# EasyEDA Pro project 键盘.eprj, schematic 键盘原理图

## Sheets
1 键盘按键: Board Name: Board1; Create Date: 2025-09-14; Page Name: 键盘按键; Project Name: 键盘; Schematic Name: Schematic1; Update Date: 2026-02-04; Company: 嘉立创EDA; Page Size: A4; Version: V1.0
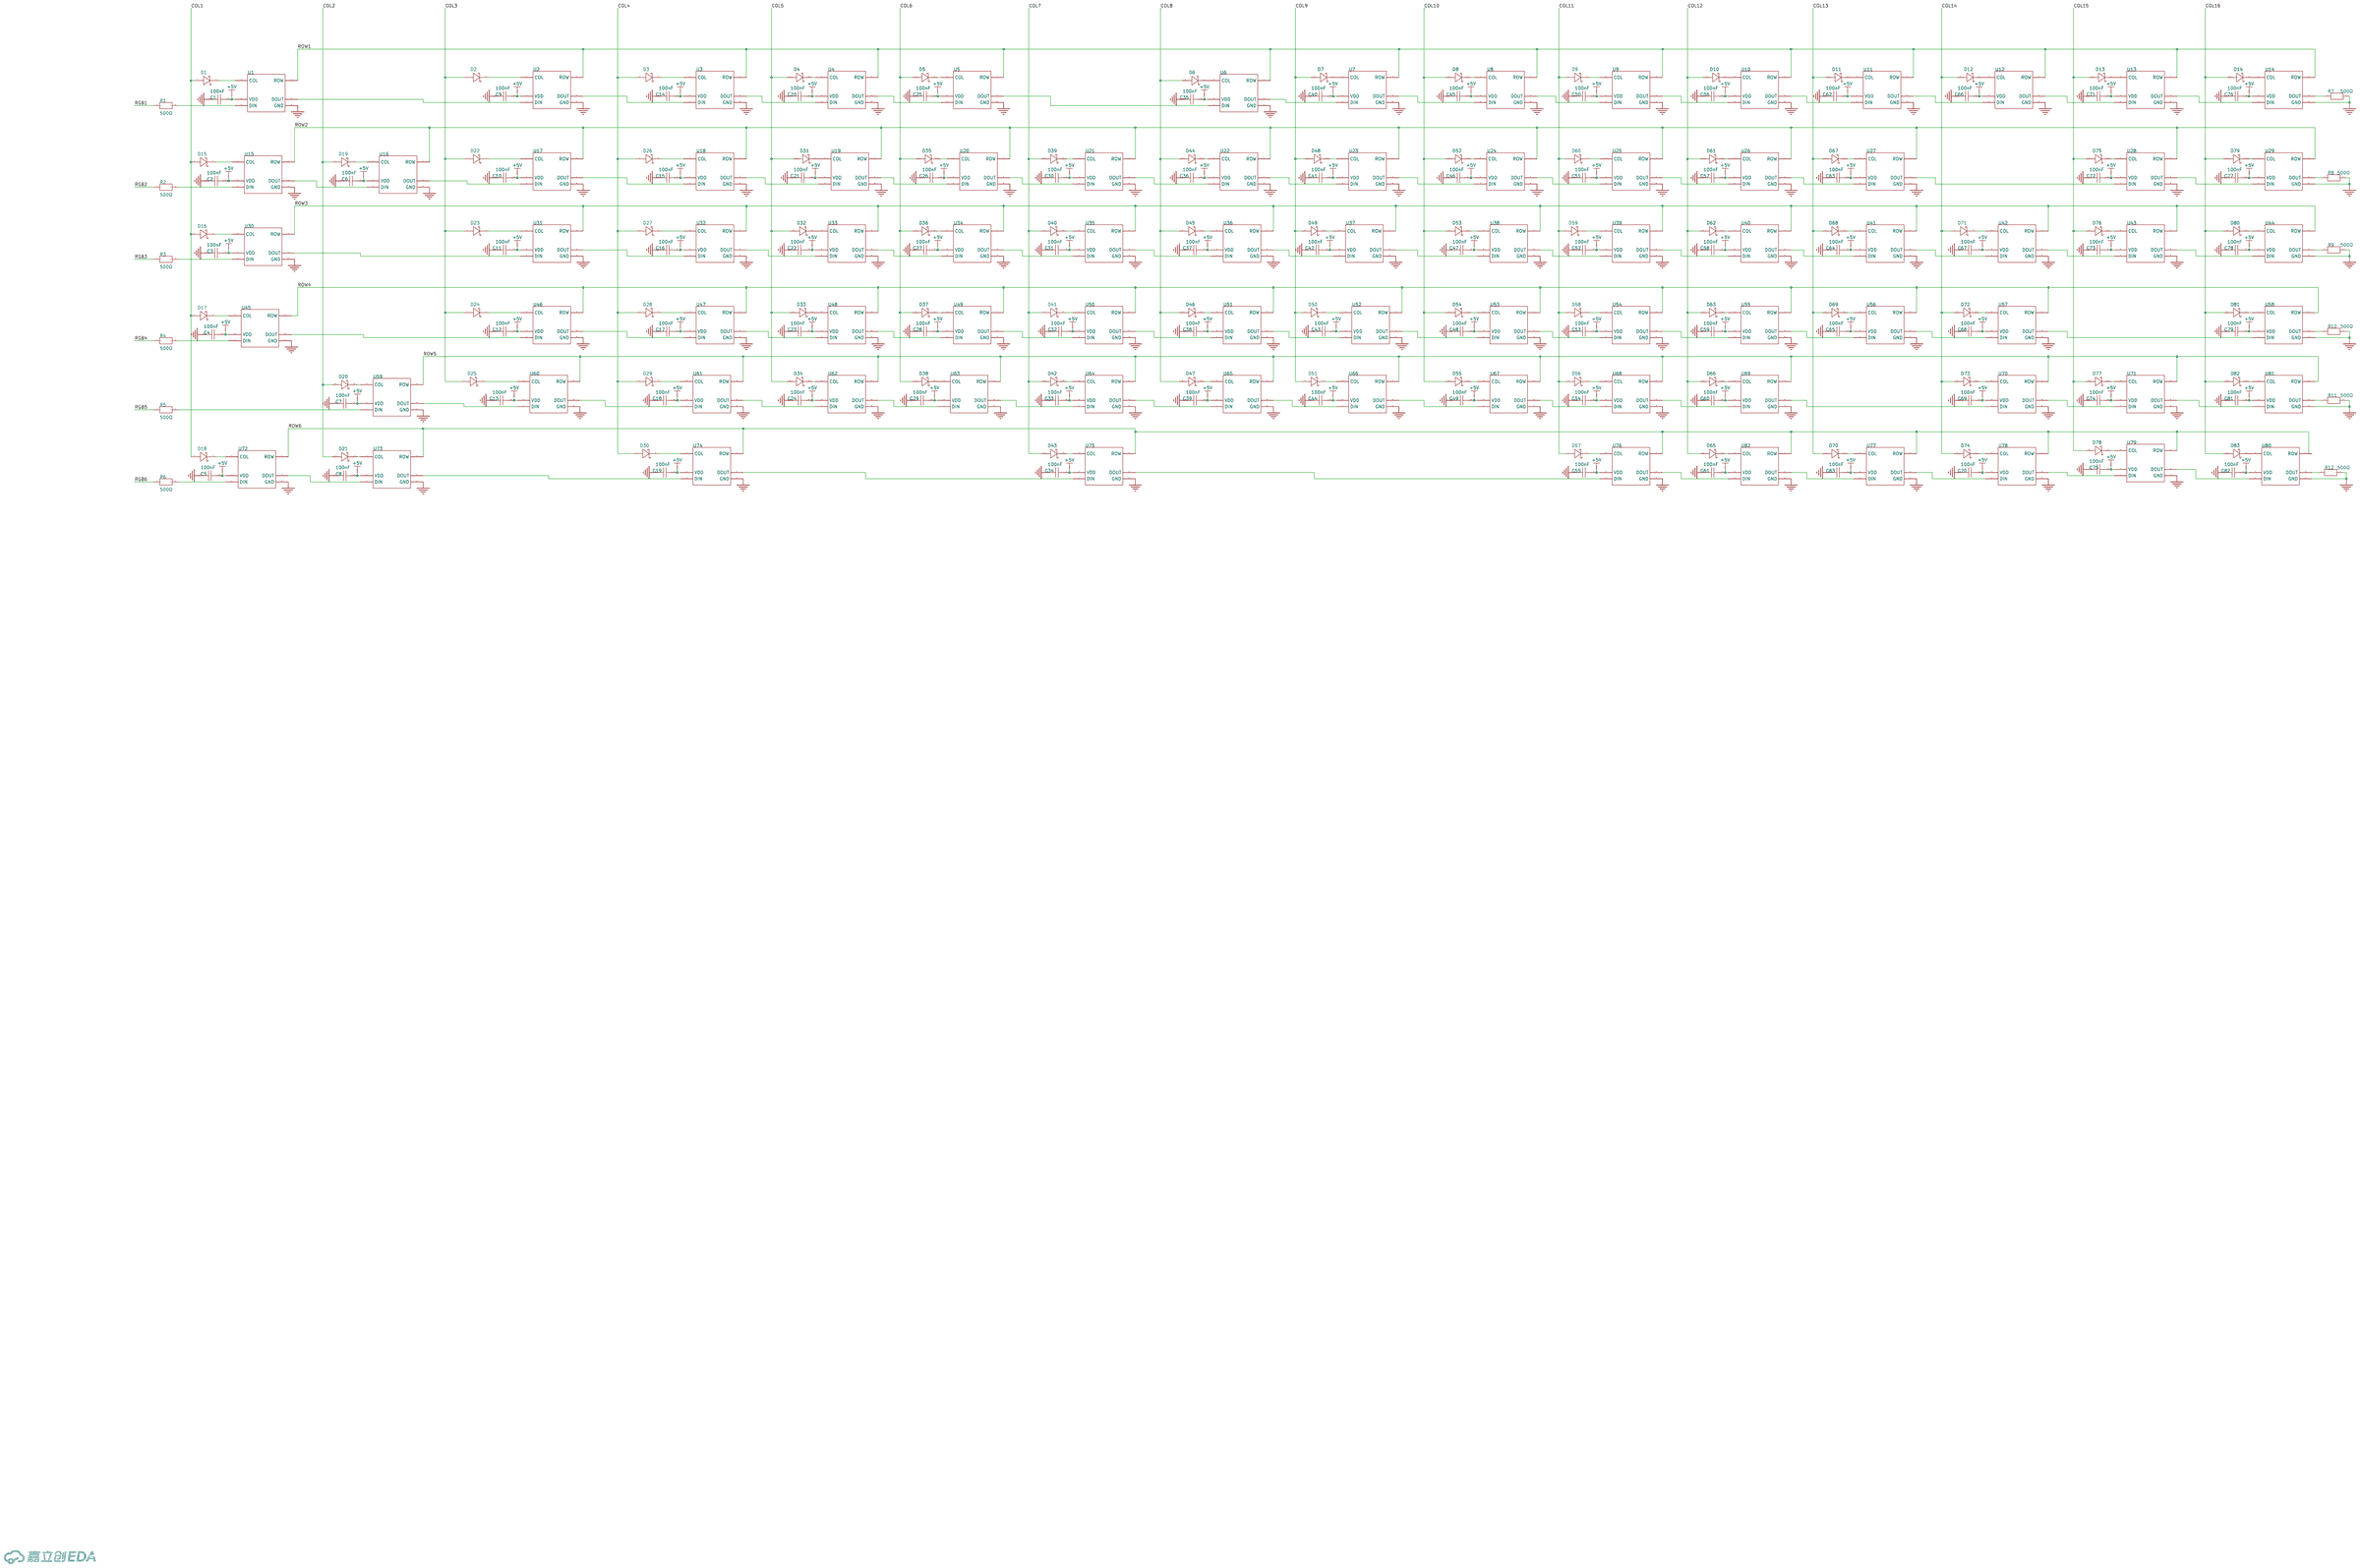
[diagram p0: 键盘按键]
2 键盘主控: Board Name: 键盘pcb; Create Date: 2026-01-15; Page Name: 键盘主控; Schematic Name: 键盘原理图; Update Date: 2026-03-28
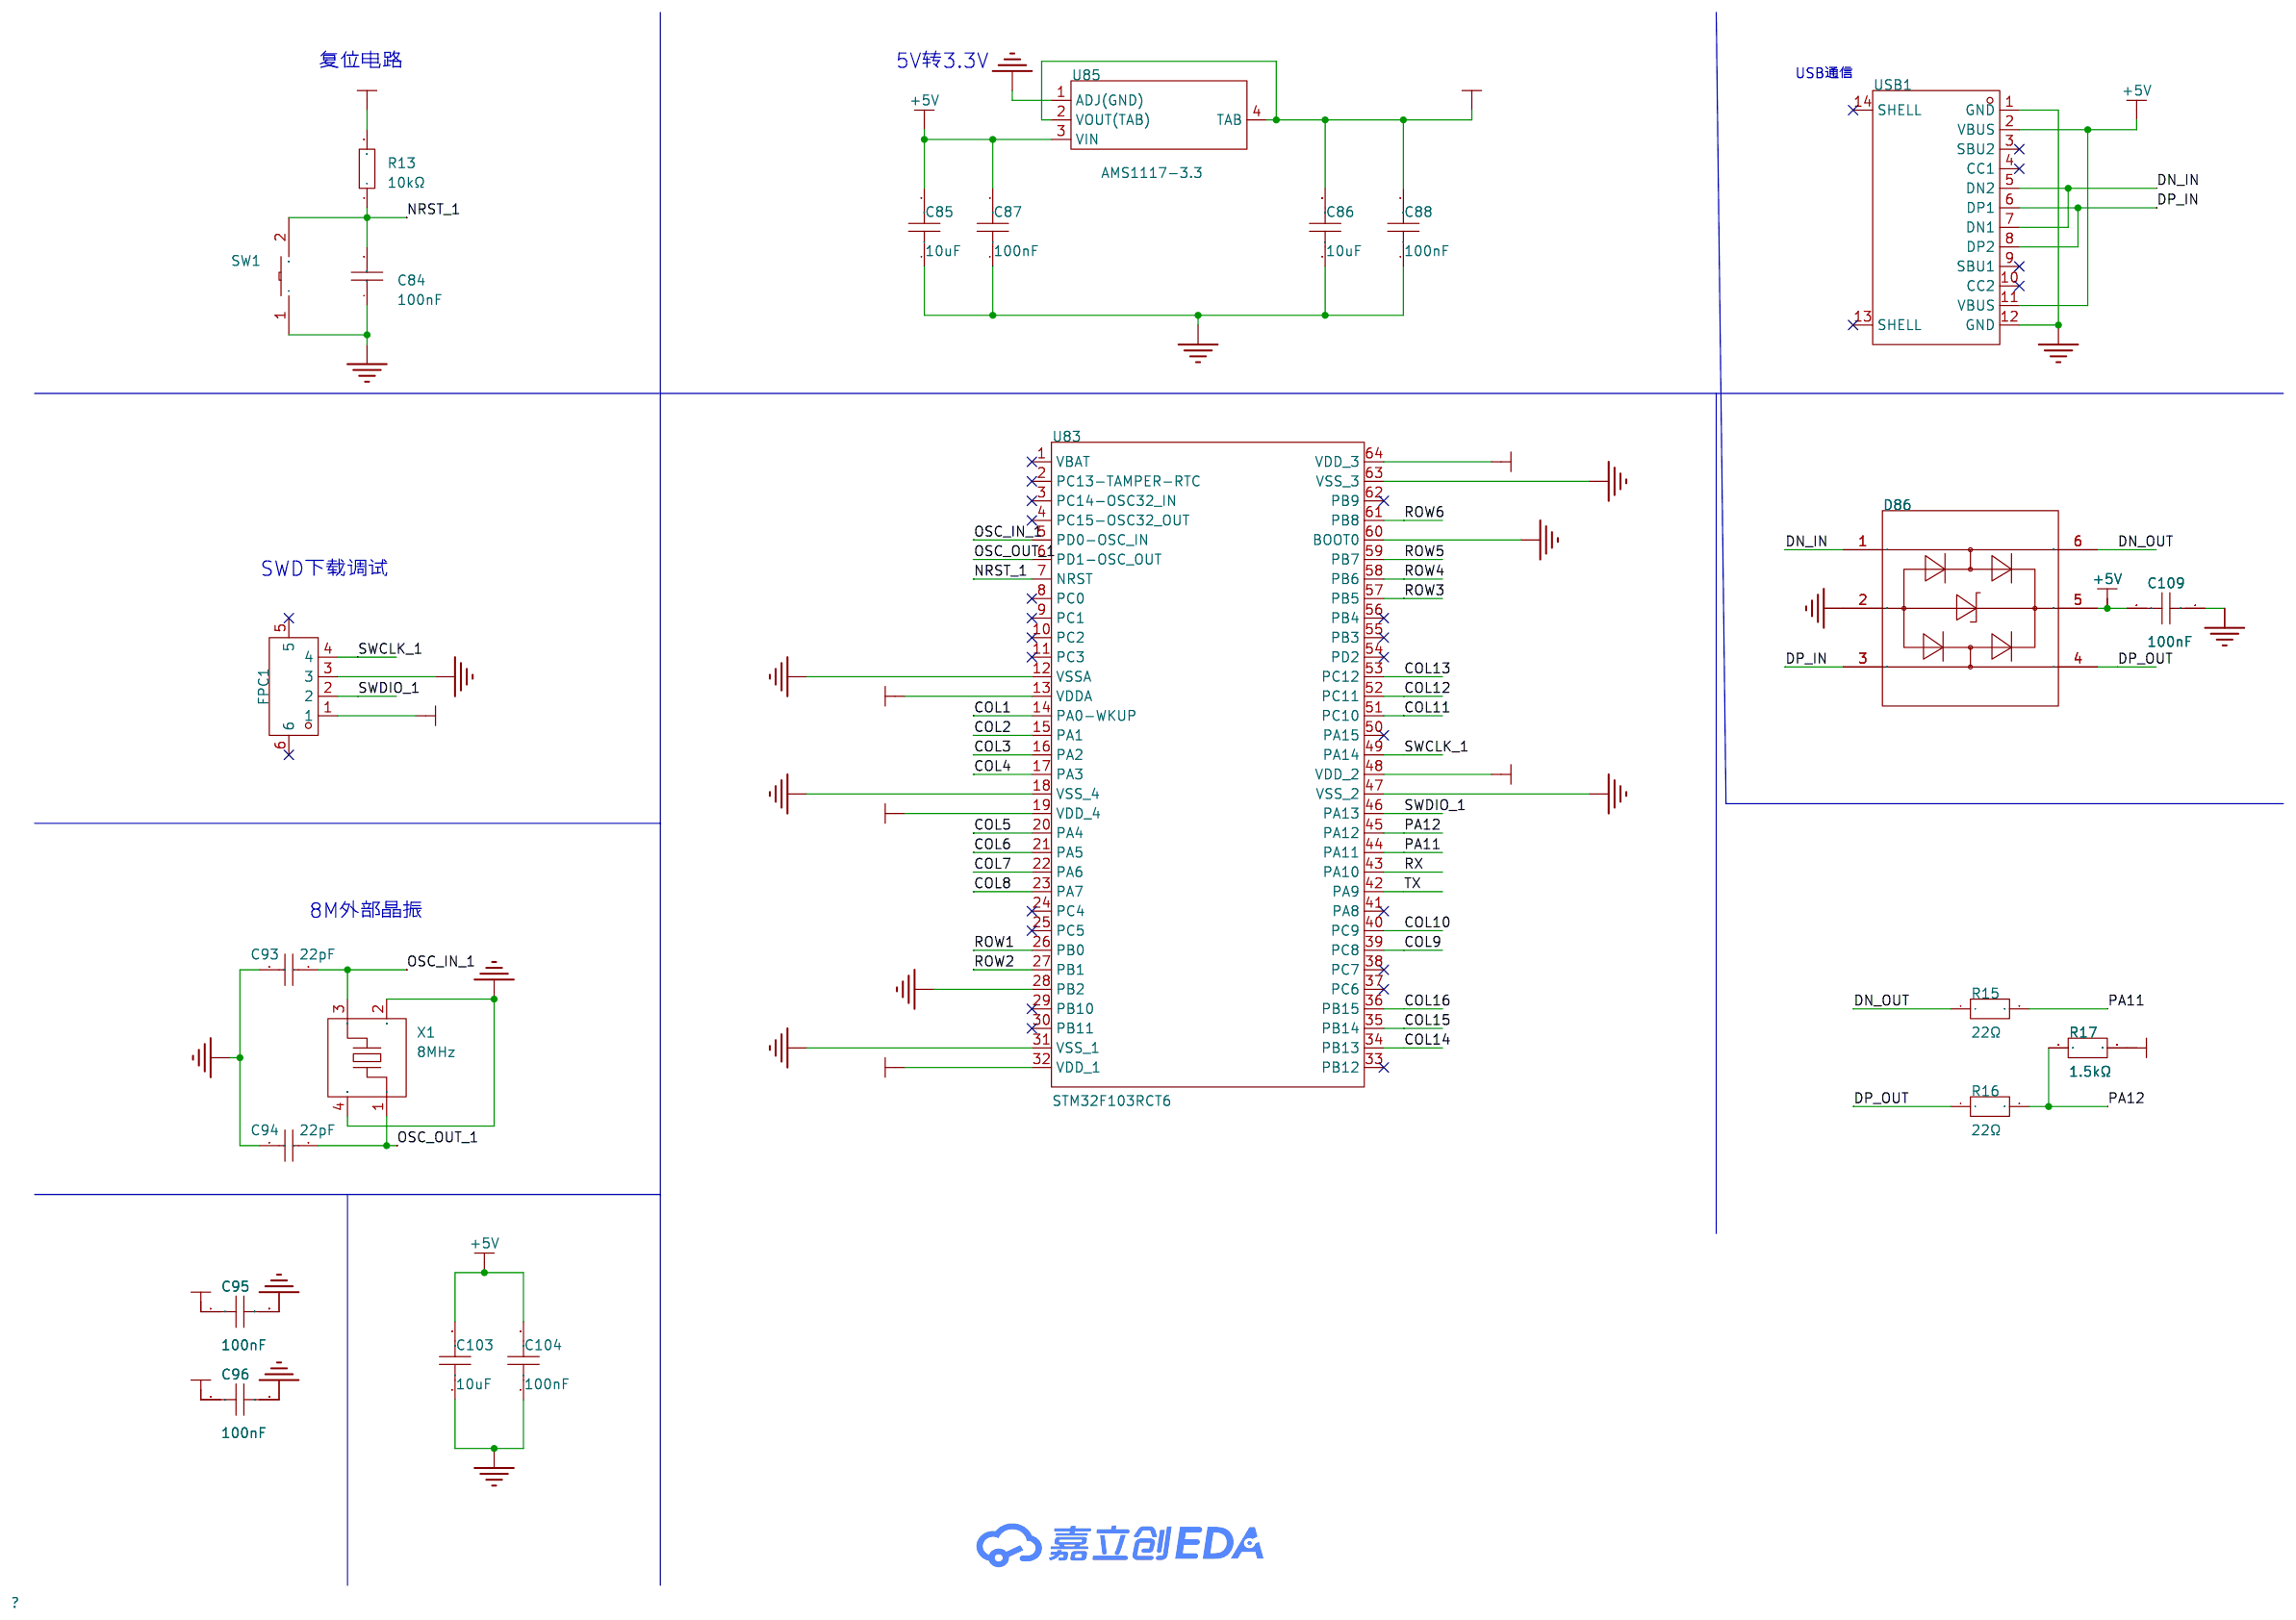
[diagram p1: 键盘主控]
3 灯光主控: Board Name: 键盘pcb; Create Date: 2026-01-15; Page Name: 灯光主控; Schematic Name: 键盘原理图; Update Date: 2026-03-28
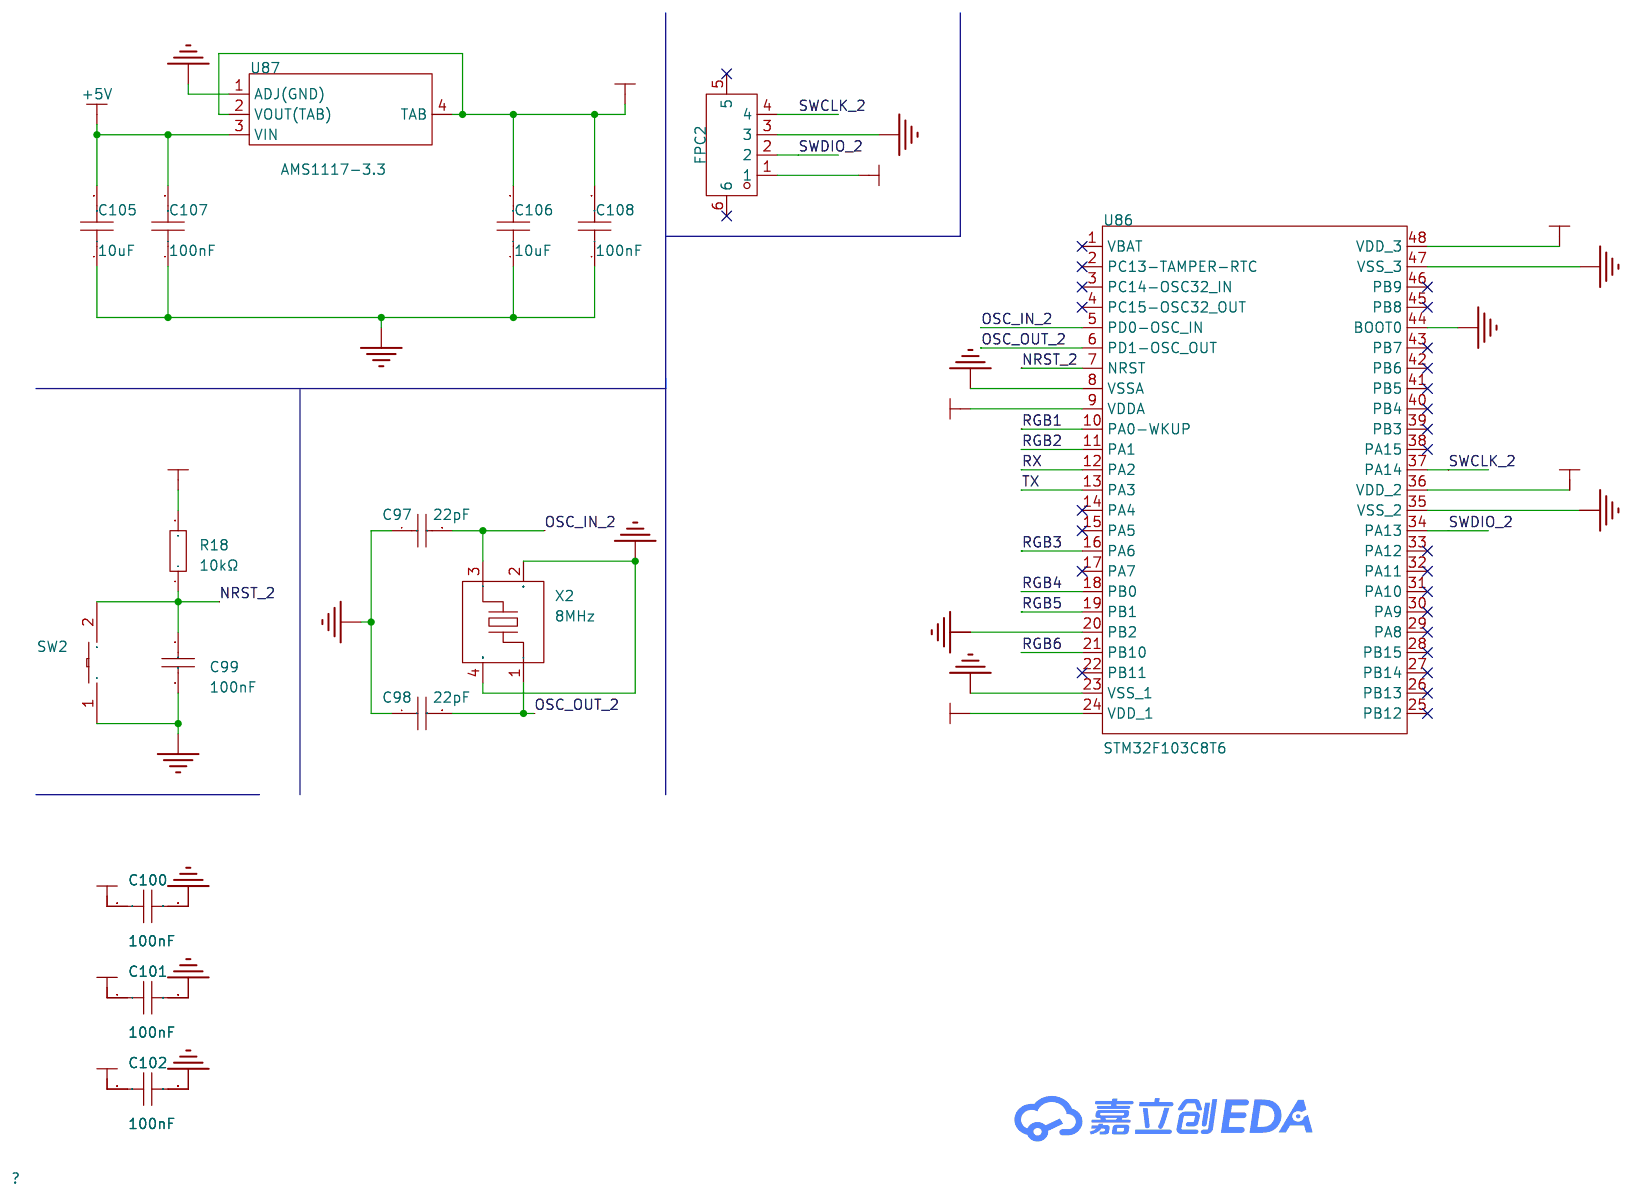
[diagram p2: 灯光主控]

## Parts
sheet 灯光主控
C97  22pF  [C0603]
C98  22pF  [C0603]
C99  100nF  [C0805]
C100  100nF  [C0603]
C101  100nF  [C0603]
C102  100nF  [C0603]
C105  10uF  [C0603]
C106  10uF  [C0603]
C107  100nF  [C0603]
C108  100nF  [C0603]
FPC2  XW05202-040R-00  [FPC-SMD_4P-P0.50_HCTL_XW05202-040R-00]
R18  10kΩ  [R0805]
SW2  TS-1101-C-W  [SW-SMD_L6.0-W3.3-LS8.0]
U86  STM32F103C8T6  [LQFP-48_L7.0-W7.0-P0.50-LS9.0-BL]
U87  AMS1117-3.3  [SOT-223-4_L6.5-W3.5-P2.30-LS7.0-BR]
X2  8MHz  [CRYSTAL-SMD_4P-L3.2-W2.5-BL]
sheet 键盘主控
C84  100nF  [C0805]
C85  10uF  [C0603]
C86  10uF  [C0603]
C87  100nF  [C0603]
C88  100nF  [C0603]
C93  22pF  [C0603]
C94  22pF  [C0603]
C95  100nF  [C0603]
C96  100nF  [C0603]
C103  10uF  [C0603]
C104  100nF  [C0603]
C109  100nF  [C0603]
D86  USBLC6-2SC6  [SOT-23-6_L2.9-W1.6-P0.95-LS2.8-BL]
FPC1  XW05202-040R-00  [FPC-SMD_4P-P0.50_HCTL_XW05202-040R-00]
R13  10kΩ  [R0805]
R15  22Ω  [R0603]
R16  22Ω  [R0603]
R17  1.5kΩ  [R0603]
SW1  TS-1101-C-W  [SW-SMD_L6.0-W3.3-LS8.0]
U83  STM32F103RCT6  [LQFP-64_L10.0-W10.0-P0.50-LS12.0-BL]
U85  AMS1117-3.3  [SOT-223-4_L6.5-W3.5-P2.30-LS7.0-BR]
USB1  TYPE-C 16PIN 2MD(073)  [USB-C-SMD_TYPE-C-6PIN-2MD-073]
X1  8MHz  [CRYSTAL-SMD_4P-L3.2-W2.5-BL]
sheet 键盘按键
C1  100nF  [C0805]
C2  100nF  [C0805]
C3  100nF  [C0805]
C4  100nF  [C0805]
C5  100nF  [C0805]
C6  100nF  [C0805]
C7  100nF  [C0805]
C8  100nF  [C0805]
C9  100nF  [C0805]
C10  100nF  [C0805]
C11  100nF  [C0805]
C12  100nF  [C0805]
C13  100nF  [C0805]
C14  100nF  [C0805]
C15  100nF  [C0805]
C16  100nF  [C0805]
C17  100nF  [C0805]
C18  100nF  [C0805]
C19  100nF  [C0805]
C20  100nF  [C0805]
C21  100nF  [C0805]
C22  100nF  [C0805]
C23  100nF  [C0805]
C24  100nF  [C0805]
C25  100nF  [C0805]
C26  100nF  [C0805]
C27  100nF  [C0805]
C28  100nF  [C0805]
C29  100nF  [C0805]
C30  100nF  [C0805]
C31  100nF  [C0805]
C32  100nF  [C0805]
C33  100nF  [C0805]
C34  100nF  [C0805]
C35  100nF  [C0805]
C36  100nF  [C0805]
C37  100nF  [C0805]
C38  100nF  [C0805]
C39  100nF  [C0805]
C40  100nF  [C0805]
C41  100nF  [C0805]
C42  100nF  [C0805]
C43  100nF  [C0805]
C44  100nF  [C0805]
C45  100nF  [C0805]
C46  100nF  [C0805]
C47  100nF  [C0805]
C48  100nF  [C0805]
C49  100nF  [C0805]
C50  100nF  [C0805]
C51  100nF  [C0805]
C52  100nF  [C0805]
C53  100nF  [C0805]
C54  100nF  [C0805]
C55  100nF  [C0805]
C56  100nF  [C0805]
C57  100nF  [C0805]
C58  100nF  [C0805]
C59  100nF  [C0805]
C60  100nF  [C0805]
C61  100nF  [C0805]
C62  100nF  [C0805]
C63  100nF  [C0805]
C64  100nF  [C0805]
C65  100nF  [C0805]
C66  100nF  [C0805]
C67  100nF  [C0805]
C68  100nF  [C0805]
C69  100nF  [C0805]
C70  100nF  [C0805]
C71  100nF  [C0805]
C72  100nF  [C0805]
C73  100nF  [C0805]
C74  100nF  [C0805]
C75  100nF  [C0805]
C76  100nF  [C0805]
C77  100nF  [C0805]
C78  100nF  [C0805]
C79  100nF  [C0805]
C81  100nF  [C0805]
C82  100nF  [C0805]
C83  100nF  [C0805]
D1  1N4148W  [SOD-123_L2.7-W1.6-LS3.7-FD]
D2  1N4148W  [SOD-123_L2.7-W1.6-LS3.7-FD]
D3  1N4148W  [SOD-123_L2.7-W1.6-LS3.7-FD]
D4  1N4148W  [SOD-123_L2.7-W1.6-LS3.7-FD]
D5  1N4148W  [SOD-123_L2.7-W1.6-LS3.7-FD]
D6  1N4148W  [SOD-123_L2.7-W1.6-LS3.7-FD]
D7  1N4148W  [SOD-123_L2.7-W1.6-LS3.7-FD]
D8  1N4148W  [SOD-123_L2.7-W1.6-LS3.7-FD]
D9  1N4148W  [SOD-123_L2.7-W1.6-LS3.7-FD]
D10  1N4148W  [SOD-123_L2.7-W1.6-LS3.7-FD]
D11  1N4148W  [SOD-123_L2.7-W1.6-LS3.7-FD]
D12  1N4148W  [SOD-123_L2.7-W1.6-LS3.7-FD]
D13  1N4148W  [SOD-123_L2.7-W1.6-LS3.7-FD]
D14  1N4148W  [SOD-123_L2.7-W1.6-LS3.7-FD]
D15  1N4148W  [SOD-123_L2.7-W1.6-LS3.7-FD]
D16  1N4148W  [SOD-123_L2.7-W1.6-LS3.7-FD]
D17  1N4148W  [SOD-123_L2.7-W1.6-LS3.7-FD]
D18  1N4148W  [SOD-123_L2.7-W1.6-LS3.7-FD]
D19  1N4148W  [SOD-123_L2.7-W1.6-LS3.7-FD]
D20  1N4148W  [SOD-123_L2.7-W1.6-LS3.7-FD]
D21  1N4148W  [SOD-123_L2.7-W1.6-LS3.7-FD]
D22  1N4148W  [SOD-123_L2.7-W1.6-LS3.7-FD]
D23  1N4148W  [SOD-123_L2.7-W1.6-LS3.7-FD]
D24  1N4148W  [SOD-123_L2.7-W1.6-LS3.7-FD]
D25  1N4148W  [SOD-123_L2.7-W1.6-LS3.7-FD]
D26  1N4148W  [SOD-123_L2.7-W1.6-LS3.7-FD]
D27  1N4148W  [SOD-123_L2.7-W1.6-LS3.7-FD]
D28  1N4148W  [SOD-123_L2.7-W1.6-LS3.7-FD]
D29  1N4148W  [SOD-123_L2.7-W1.6-LS3.7-FD]
D30  1N4148W  [SOD-123_L2.7-W1.6-LS3.7-FD]
D31  1N4148W  [SOD-123_L2.7-W1.6-LS3.7-FD]
D32  1N4148W  [SOD-123_L2.7-W1.6-LS3.7-FD]
D33  1N4148W  [SOD-123_L2.7-W1.6-LS3.7-FD]
D34  1N4148W  [SOD-123_L2.7-W1.6-LS3.7-FD]
D35  1N4148W  [SOD-123_L2.7-W1.6-LS3.7-FD]
D36  1N4148W  [SOD-123_L2.7-W1.6-LS3.7-FD]
D37  1N4148W  [SOD-123_L2.7-W1.6-LS3.7-FD]
D38  1N4148W  [SOD-123_L2.7-W1.6-LS3.7-FD]
D39  1N4148W  [SOD-123_L2.7-W1.6-LS3.7-FD]
D40  1N4148W  [SOD-123_L2.7-W1.6-LS3.7-FD]
D41  1N4148W  [SOD-123_L2.7-W1.6-LS3.7-FD]
D42  1N4148W  [SOD-123_L2.7-W1.6-LS3.7-FD]
D43  1N4148W  [SOD-123_L2.7-W1.6-LS3.7-FD]
D44  1N4148W  [SOD-123_L2.7-W1.6-LS3.7-FD]
D45  1N4148W  [SOD-123_L2.7-W1.6-LS3.7-FD]
D46  1N4148W  [SOD-123_L2.7-W1.6-LS3.7-FD]
D47  1N4148W  [SOD-123_L2.7-W1.6-LS3.7-FD]
D48  1N4148W  [SOD-123_L2.7-W1.6-LS3.7-FD]
D49  1N4148W  [SOD-123_L2.7-W1.6-LS3.7-FD]
D50  1N4148W  [SOD-123_L2.7-W1.6-LS3.7-FD]
D51  1N4148W  [SOD-123_L2.7-W1.6-LS3.7-FD]
D52  1N4148W  [SOD-123_L2.7-W1.6-LS3.7-FD]
D53  1N4148W  [SOD-123_L2.7-W1.6-LS3.7-FD]
D54  1N4148W  [SOD-123_L2.7-W1.6-LS3.7-FD]
D55  1N4148W  [SOD-123_L2.7-W1.6-LS3.7-FD]
D56  1N4148W  [SOD-123_L2.7-W1.6-LS3.7-FD]
D57  1N4148W  [SOD-123_L2.7-W1.6-LS3.7-FD]
D58  1N4148W  [SOD-123_L2.7-W1.6-LS3.7-FD]
D59  1N4148W  [SOD-123_L2.7-W1.6-LS3.7-FD]
D60  1N4148W  [SOD-123_L2.7-W1.6-LS3.7-FD]
D61  1N4148W  [SOD-123_L2.7-W1.6-LS3.7-FD]
D62  1N4148W  [SOD-123_L2.7-W1.6-LS3.7-FD]
D63  1N4148W  [SOD-123_L2.7-W1.6-LS3.7-FD]
D65  1N4148W  [SOD-123_L2.7-W1.6-LS3.7-FD]
D66  1N4148W  [SOD-123_L2.7-W1.6-LS3.7-FD]
D67  1N4148W  [SOD-123_L2.7-W1.6-LS3.7-FD]
D68  1N4148W  [SOD-123_L2.7-W1.6-LS3.7-FD]
D69  1N4148W  [SOD-123_L2.7-W1.6-LS3.7-FD]
D70  1N4148W  [SOD-123_L2.7-W1.6-LS3.7-FD]
D71  1N4148W  [SOD-123_L2.7-W1.6-LS3.7-FD]
D72  1N4148W  [SOD-123_L2.7-W1.6-LS3.7-FD]
D73  1N4148W  [SOD-123_L2.7-W1.6-LS3.7-FD]
D74  1N4148W  [SOD-123_L2.7-W1.6-LS3.7-FD]
D75  1N4148W  [SOD-123_L2.7-W1.6-LS3.7-FD]
D76  1N4148W  [SOD-123_L2.7-W1.6-LS3.7-FD]
D77  1N4148W  [SOD-123_L2.7-W1.6-LS3.7-FD]
D78  1N4148W  [SOD-123_L2.7-W1.6-LS3.7-FD]
D79  1N4148W  [SOD-123_L2.7-W1.6-LS3.7-FD]
D80  1N4148W  [SOD-123_L2.7-W1.6-LS3.7-FD]
D81  1N4148W  [SOD-123_L2.7-W1.6-LS3.7-FD]
D82  1N4148W  [SOD-123_L2.7-W1.6-LS3.7-FD]
D83  1N4148W  [SOD-123_L2.7-W1.6-LS3.7-FD]
R1  500Ω  [R0805]
R2  500Ω  [R0805]
R3  500Ω  [R0805]
R4  500Ω  [R0805]
R5  500Ω  [R0805]
R6  500Ω  [R0805]
R7  500Ω  [R0805]
R8  500Ω  [R0805]
R9  500Ω  [R0805]
R10  500Ω  [R0805]
R11  500Ω  [R0805]
R12  500Ω  [R0805]
U1  -  [凯华rgb轴座5脚]
U2  -  [凯华rgb轴座5脚]
U3  -  [凯华rgb轴座5脚]
U4  -  [凯华rgb轴座5脚]
U5  -  [凯华rgb轴座5脚]
U6  -  [凯华rgb轴座5脚]
U7  -  [凯华rgb轴座5脚]
U8  -  [凯华rgb轴座5脚]
U9  -  [凯华rgb轴座5脚]
U10  -  [凯华rgb轴座5脚]
U11  -  [凯华rgb轴座5脚]
U12  -  [凯华rgb轴座5脚]
U13  -  [凯华rgb轴座5脚]
U14  -  [凯华rgb轴座5脚]
U15  -  [凯华rgb轴座5脚]
U16  -  [凯华rgb轴座5脚]
U17  -  [凯华rgb轴座5脚]
U18  -  [凯华rgb轴座5脚]
U19  -  [凯华rgb轴座5脚]
U20  -  [凯华rgb轴座5脚]
U21  -  [凯华rgb轴座5脚]
U22  -  [凯华rgb轴座5脚]
U23  -  [凯华rgb轴座5脚]
U24  -  [凯华rgb轴座5脚]
U25  -  [凯华rgb轴座5脚]
U26  -  [凯华rgb轴座5脚]
U27  -  [凯华rgb轴座5脚]
U28  -  [凯华rgb轴座5脚]
U29  -  [凯华rgb轴座5脚]
U30  -  [凯华rgb轴座5脚]
U31  -  [凯华rgb轴座5脚]
U32  -  [凯华rgb轴座5脚]
U33  -  [凯华rgb轴座5脚]
U34  -  [凯华rgb轴座5脚]
U35  -  [凯华rgb轴座5脚]
U36  -  [凯华rgb轴座5脚]
U37  -  [凯华rgb轴座5脚]
U38  -  [凯华rgb轴座5脚]
U39  -  [凯华rgb轴座5脚]
U40  -  [凯华rgb轴座5脚]
U41  -  [凯华rgb轴座5脚]
U42  -  [凯华rgb轴座5脚]
U43  -  [凯华rgb轴座5脚]
U44  -  [凯华rgb轴座5脚]
U45  -  [凯华rgb轴座5脚]
U46  -  [凯华rgb轴座5脚]
U47  -  [凯华rgb轴座5脚]
U48  -  [凯华rgb轴座5脚]
U49  -  [凯华rgb轴座5脚]
U50  -  [凯华rgb轴座5脚]
U51  -  [凯华rgb轴座5脚]
U52  -  [凯华rgb轴座5脚]
U53  -  [凯华rgb轴座5脚]
U54  -  [凯华rgb轴座5脚]
U55  -  [凯华rgb轴座5脚]
U56  -  [凯华rgb轴座5脚]
U57  -  [凯华rgb轴座5脚]
U58  -  [凯华rgb轴座5脚]
U59  -  [凯华rgb轴座5脚]
U60  -  [凯华rgb轴座5脚]
U61  -  [凯华rgb轴座5脚]
U62  -  [凯华rgb轴座5脚]
U63  -  [凯华rgb轴座5脚]
U64  -  [凯华rgb轴座5脚]
U65  -  [凯华rgb轴座5脚]
U66  -  [凯华rgb轴座5脚]
U67  -  [凯华rgb轴座5脚]
U68  -  [凯华rgb轴座5脚]
U69  -  [凯华rgb轴座5脚]
U70  -  [凯华rgb轴座5脚]
U71  -  [凯华rgb轴座5脚]
U72  -  [凯华rgb轴座5脚]
U73  -  [凯华rgb轴座5脚]
U74  -  [凯华rgb轴座5脚]
U75  -  [凯华rgb轴座5脚]
U76  -  [凯华rgb轴座5脚]
U77  -  [凯华rgb轴座5脚]
U78  -  [凯华rgb轴座5脚]
U79  -  [凯华rgb轴座5脚]
U80  -  [凯华rgb轴座5脚]
U81  -  [凯华rgb轴座5脚]
U82  -  [凯华rgb轴座5脚]

## Library data of the parts
C93 C94 C97 C98 = CL21C220JBANNNC: 容值:22pF;精度:±5%;额定电压:50V;温度系数:C0G;; LCSC Part Name: 22pF ±5% 50V; Supplier Part: C1804; Manufacturer: SAMSUNG(三星); Supplier Footprint: 0805; JLCPCB Part Class: 基础库; Datasheet: https://item.szlcsc.com/datasheet/CL21C220JBANNNC/2156.html; Supplier: LCSC; Tolerance: ±5%; Voltage Rating: 50V; Temperature Coefficient: C0G
C84 C99 = CL21B104KBCNNNC: LCSC Part Name: 100nF ±10% 50V; Supplier Part: C1711; Manufacturer: SAMSUNG(三星); Supplier Footprint: 0805; JLCPCB Part Class: 扩展库; Datasheet: https://item.szlcsc.com/datasheet/CL21B104KBCNNNC/2063.html; Supplier: LCSC; Tolerance: ±10%; Voltage Rating: 50V; Temperature Coefficient: X7R
C95 C96 C100-C102 = C0603C104M4RACTU: LCSC Part Name: 100nF ±20%; Supplier Part: C19711686; Manufacturer: KEMET(基美); Supplier Footprint: 0603; JLCPCB Part Class: 扩展库; Datasheet: https://item.szlcsc.com/datasheet/C0603C104M4RACTU/21023289.html; Supplier: LCSC; Tolerance: ±20%; Temperature Coefficient: X7R
C85 C86 C103 C105 C106 = CL21A106KAYNNNE_C15850: 容值:10uF;精度:±10%;额定电压:25V;温度系数:X5R;; LCSC Part Name: 10uF ±10% 25V; Supplier Part: C15850; Manufacturer: SAMSUNG(三星); Manufacturer Part: CL21A106KAYNNNE; Supplier Footprint: 0805; JLCPCB Part Class: 基础库; Datasheet: https://item.szlcsc.com/datasheet/CL21A106KAYNNNE/16532.html; Supplier: LCSC; Tolerance: ±10%; Voltage Rating: 25V; Temperature Coefficient: X5R
C87 C88 C104 C107-C109 = CC0805KRX7R8BB104: 容值:100nF;精度:±10%;额定电压:25V;温度系数:X7R;; LCSC Part Name: 100nF ±10% 25V; Supplier Part: C519981; Manufacturer: YAGEO(国巨); Supplier Footprint: 0805; JLCPCB Part Class: 扩展库; Datasheet: https://item.szlcsc.com/datasheet/CC0805KRX7R8BB104/536672.html; Supplier: LCSC; Tolerance: ±10%; Voltage Rating: 25V; Temperature Coefficient: X7R
FPC1 FPC2 = XW05202-040R-00: 锁定特性:翻盖式;触点类型:下接;触点数量:4P;间距:0.5mm;安装类型:卧贴;工作温度范围:-25℃~+85℃;; LCSC Part Name: 翻盖式 下接 P数:4P 间距:0.5mm; Supplier Part: C2906108; Manufacturer: HCTL(华灿天禄); Supplier Footprint: SMD,P=0.5mm,卧贴; JLCPCB Part Class: 扩展库; Datasheet: https://atta.szlcsc.com/upload/public/pdf/source/20231106/C384EBACC26E247929F51DC405C2A717.pdf; Supplier: LCSC; Locking Feature: 翻盖式; Contact Type: 下接; Number of Contacts: 4P; Pitch: 0.5mm; Mounting Type: 卧贴; FFC, FCB Thickness: 0.3mm; Height Above Board: 2mm; Contact Material: 铜合金; Contact Plating: 锡; Operating Temperature Range: -25℃~+85℃
R13 R18 = RC0805FR-0710KL: 电阻类型:厚膜电阻;阻值:10kΩ;精度:±1%;功率:125mW;工作电压:150V;温度系数:±100ppm/℃;; LCSC Part Name: 厚膜电阻 10kΩ ±1% 125mW; Supplier Part: C84376; Manufacturer: YAGEO(国巨); Supplier Footprint: 0805; JLCPCB Part Class: 扩展库; Datasheet: https://atta.szlcsc.com/upload/public/pdf/source/20250610/89E4D743C004A82A45145C7A2CC3A578.pdf; Supplier: LCSC; Type: 厚膜电阻; Tolerance: ±1%; Power(Watts): 125mW; Voltage-Supply(Max): 150V; Temperature Coefficient: ±100ppm/℃; Operating Temperature: -55℃~+155℃
SW1 SW2 = TS-1101-C-W: 电路结构:单刀单掷;按钮形状:矩形按钮;作用力:260gf;安装方式:立贴;开关长度:6mm;开关宽度:3.6mm;开关高度:2.5mm;带支架:不带;触点电流:50mA;额定电压(AC):-;额定电压(DC):12V;额定功率:-;绝缘电阻:-;带灯:无;机械寿命:5万次;; LCSC Part Name: 6*3.6*2.5mm 立贴 轻触开关; Supplier Part: C318938; Manufacturer: XKB Connectivity(中国星坤); Supplier Footprint: SMD; JLCPCB Part Class: 扩展库; Datasheet: https://atta.szlcsc.com/upload/public/pdf/source/20200227/C318938_C2E53B1EEDE37D980A33616AC086DE53.pdf; Supplier: LCSC; Circuit: 单刀单掷; Actuator Style: 矩形按钮; Operating Force: 260gf; Mounting Style: 立贴; Switch Length: 6mm; Switch Width: 3.6mm; Switch Height: 2.5mm; Strike Gundam: 不带; Contact Current: 50mA; Voltage Rating (DC): 12V; Actuator/Cap Color: 白色带淡绿; With Lamp: 无; Mechanical Life: 5万次; Operating Temperature: -30℃~+85℃
U86 = STM32F103C8T6: LCSC Part Name: 主流增强型ARM Cortex-M3 MCU，具有64 KB Flash、72 MHz CPU、电机控制、USB和CAN; Supplier Part: C8734; Manufacturer: ST(意法半导体); Supplier Footprint: LQFP-48(7x7); JLCPCB Part Class: 扩展库; Datasheet: https://item.szlcsc.com/datasheet/STM32F103C8T6/9243.html; Supplier: LCSC; CPU Core: ARM-M3; CPU Maximum Speed: 72MHz; Program Storage Size: 64KB; Program Memory Type: FLASH; Number of I/O: 37; ADC (Bit): 12bit; Voltage - Supply: 2V~3.6V
U85 U87 = AMS1117-3.3_C347222: 输出类型:固定;工作电压:12V;输出电压:3.3V;输出电流:1A;电源纹波抑制比(PSRR):60dB@(120Hz);输出极性:正极;; LCSC Part Name: 输出:3.3V 电流:1A 耐压:12V; Supplier Part: C347222; Manufacturer: UMW(友台半导体); Supplier Footprint: SOT-223; JLCPCB Part Class: 扩展库; Datasheet: https://item.szlcsc.com/datasheet/AMS1117-3.3/323882.html; Supplier: LCSC; Output Type: 固定; Voltage - Supply: 12V; Output Voltage: 3.3V; Output Current: 1A; Power Supply Rejection Ratio (PSRR): 60dB@(120Hz); Voltage Dropout: 1.3V@(1A); Features: 过流保护; Output Configuration: 正极; Number of Outputs: 1
X1 X2 = XL2EL89CSI-KPIYLC-8M: 晶振类型:贴片晶振;频率:8MHz;常温频差:±10ppm;负载电容:20pF;频率稳定度:±20ppm;; LCSC Part Name: YSX321SL 8MHZ 4P 3225 20PF ±10PPM -40~85℃ (±20PPM); Supplier Part: C42400161; Manufacturer: YXC(扬兴晶振); Supplier Footprint: SMD3225-4P; JLCPCB Part Class: 扩展库; Datasheet: https://item.szlcsc.com/datasheet/XL2EL89CSI-KPIYLC-8M/44352056.html; Supplier: LCSC; Type: 贴片晶振; Normal temperature Frequency Tolerance: ±10ppm; Load Capacitance: 20pF; Frequency Stability: ±20ppm; Operating Temperature: -40℃~+85℃
D86 = USBLC6-2SC6_C7519: LCSC Part Name: 单向ESD; Supplier Part: C7519; Manufacturer: ST(意法半导体); Supplier Footprint: SOT-23-6L; JLCPCB Part Class: 扩展库; Datasheet: https://item.szlcsc.com/datasheet/USBLC6-2SC6/7996.html; Supplier: LCSC; Polarity: 单向; Reverse Stand-Off Voltage (Vrwm): 5.25V; Clamping Voltage: 17V; Peak Pulse Current (Ipp): 5A; Voltage - Breakdown: 6V; Reverse Leakage Current (Ir): 150nA; Number of Channels: 双路; Operating Temperature: -40℃~+125℃; level of protection: IEC 61000-4-2; Type: ESD; Junction Capacitance: 3.5pF
R15 R16 = SR0603FR-7T22RL: LCSC Part Name: 厚膜电阻 22Ω ±1% 250mW; Supplier Part: C873681; Manufacturer: YAGEO(国巨); Supplier Footprint: 0603; JLCPCB Part Class: 扩展库; Datasheet: https://item.szlcsc.com/datasheet/SR0603FR-7T22RL/933793.html; Supplier: LCSC; Type: 厚膜电阻; Tolerance: ±1%; Power(Watts): 250mW; Voltage-Supply(Max): 150V; Temperature Coefficient: ±200ppm/℃; Operating Temperature: -55℃~+155℃
R17 = CL0603JN1K5P: LCSC Part Name: 厚膜电阻 1.5kΩ ±5% 100mW; Supplier Part: C49254191; Manufacturer: 昶龙科技; Supplier Footprint: 0603; JLCPCB Part Class: 扩展库; Datasheet: https://item.szlcsc.com/datasheet/CL0603JN1K5P/51688136.html; Supplier: LCSC; Type: 厚膜电阻; Tolerance: ±5%; Power(Watts): 100mW; Voltage-Supply(Max): 75V; Operating Temperature: -55℃~+70℃
U83 = STM32F103RCT6: LCSC Part Name: 主流增强型ARM Cortex-M3 MCU，具有256 KB Flash、72 MHz CPU、电机控制、USB和CAN; Supplier Part: C8323; Manufacturer: ST(意法半导体); Supplier Footprint: LQFP-64(10x10); JLCPCB Part Class: 扩展库; Datasheet: https://item.szlcsc.com/datasheet/STM32F103RCT6/8815.html; Supplier: LCSC; CPU Core: ARM-M3; CPU Maximum Speed: 72MHz; Program Storage Size: 256KB; Program Memory Type: FLASH; Number of I/O: 51; ADC (Bit): 12bit; DAC (Bit): 12bit; Voltage - Supply: 2V~3.6V
USB1 = TYPE-C 16PIN 2MD(073): 连接器类型:Type-C;协议标准:-;公母:母;安装方式:卧贴;触点数量:16P;端口数量:1;额定电流 - 电源:3A;工作温度:-25℃~+85℃;; LCSC Part Name: Type-C 母 卧贴; Supplier Part: C2765186; Manufacturer: SHOU HAN(首韩); Supplier Footprint: SMD; JLCPCB Part Class: 扩展库; Datasheet: https://item.szlcsc.com/datasheet/TYPE-C%252016PIN%25202MD(073)/2901843.html; Supplier: LCSC; Connector Type: Type-C; Gender: 母; Mounting Type: 卧贴; Number of Contacts: 16P; Number of Ports: 1; Current Rating-Power: 3A; Voltage Rating: 5V; Connect-Disconnect Life: 5千次; Detection color: 黑色; Operating Temperature: -25℃~+85℃
C1-C79 C81-C83 = CC0805KRX7R9BB104: LCSC Part Name: 100nF ±10% 50V; Supplier Part: C49678; Manufacturer: YAGEO(国巨); Supplier Footprint: 0805; JLCPCB Part Class: 基础库; Datasheet: https://item.szlcsc.com/datasheet/CC0805KRX7R9BB104/50686.html; Supplier: LCSC; Tolerance: ±10%; Voltage Rating: 50V; Temperature Coefficient: X7R
D1-D63 D65-D83 = 1N4148W_C7420318: Supplier Part: C7420318; Manufacturer: R+O(宏嘉诚); Supplier Footprint: SOD-123; JLCPCB Part Class: 扩展库; Datasheet: https://item.szlcsc.com/datasheet/1N4148W/8397140.html; Supplier: LCSC; Diode Configuration: 独立式; Voltage - Forward(Vf@If): 1.25V@150mA; Voltage - DC Reverse(Vr): 100V; Current - Rectified: 150mA; Pd - Power Dissipation: 400mW; Reverse Leakage Current (Ir): 1uA@75V; Reverse Recovery Time (trr): 4ns; Operating Junction Temperature Range: -55℃~+150℃; Non-Repetitive Peak Forward Surge Current: 2A
R1-R12 = ARG05BTC5000: LCSC Part Name: 薄膜电阻 500Ω ±0.1% 125mW; Supplier Part: C2828711; Manufacturer: Viking(光颉); Supplier Footprint: 0805; JLCPCB Part Class: 扩展库; Datasheet: https://item.szlcsc.com/datasheet/ARG05BTC5000/2977180.html; Supplier: LCSC; Type: 薄膜电阻; Tolerance: ±0.1%; Power(Watts): 125mW; Voltage-Supply(Max): 150V; Temperature Coefficient: ±25ppm/℃; Operating Temperature: -55℃~+155℃
U1-U82 = 凯华rgb键轴

## Nets
3V3_1: C86.2 C88.2 C95.1 C96.1 FPC1.1 R13.2 R17.2 U83.13(VDDA) U83.19(VDD_4) U83.32(VDD_1) U83.48(VDD_2) U83.64(VDD_3) U85.2(VOUT(TAB)) U85.4(TAB)
3V3_2: C100.1 C101.1 C102.1 C106.2 C108.2 FPC2.1 R18.2 U86.9(VDDA) U86.24(VDD_1) U86.36(VDD_2) U86.48(VDD_3) U87.2(VOUT(TAB)) U87.4(TAB)
+5V: C1.2 C2.2 C3.2 C4.2 C5.2 C6.2 C7.2 C8.2 C9.2 C10.2 C11.2 C12.2 C13.2 C14.2 C15.2 C16.2 C17.2 C18.2 C19.2 C20.2 C21.2 C22.2 C23.2 C24.2 C25.2 C26.2 C27.2 C28.2 C29.2 C30.2 C31.2 C32.2 C33.2 C34.2 C35.2 C36.2 C37.2 C38.2 C39.2 C40.2 C41.2 C42.2 C43.2 C44.2 C45.2 C46.2 C47.2 C48.2 C49.2 C50.2 C51.2 C52.2 C53.2 C54.2 C55.2 C56.2 C57.2 C58.2 C59.2 C60.2 C61.2 C62.2 C63.2 C64.2 C65.2 C66.2 C67.2 C68.2 C69.2 C70.2 C71.2 C72.2 C73.2 C74.2 C75.2 C76.2 C77.2 C78.2 C79.2 C81.2 C82.2 C83.2 C85.2 C87.2 C103.2 C104.2 C105.2 C107.2 C109.2 D86.5 U1.3(VDD) U2.3(VDD) U3.3(VDD) U4.3(VDD) U5.3(VDD) U6.3(VDD) U7.3(VDD) U8.3(VDD) U9.3(VDD) U10.3(VDD) U11.3(VDD) U12.3(VDD) U13.3(VDD) U14.3(VDD) U15.3(VDD) U16.3(VDD) U17.3(VDD) U18.3(VDD) U19.3(VDD) U20.3(VDD) U21.3(VDD) U22.3(VDD) U23.3(VDD) U24.3(VDD) U25.3(VDD) U26.3(VDD) U27.3(VDD) U28.3(VDD) U29.3(VDD) U30.3(VDD) U31.3(VDD) U32.3(VDD) U33.3(VDD) U34.3(VDD) U35.3(VDD) U36.3(VDD) U37.3(VDD) U38.3(VDD) U39.3(VDD) U40.3(VDD) U41.3(VDD) U42.3(VDD) U43.3(VDD) U44.3(VDD) U45.3(VDD) U46.3(VDD) U47.3(VDD) U48.3(VDD) U49.3(VDD) U50.3(VDD) U51.3(VDD) U52.3(VDD) U53.3(VDD) U54.3(VDD) U55.3(VDD) U56.3(VDD) U57.3(VDD) U58.3(VDD) U59.3(VDD) U60.3(VDD) U61.3(VDD) U62.3(VDD) U63.3(VDD) U64.3(VDD) U65.3(VDD) U66.3(VDD) U67.3(VDD) U68.3(VDD) U69.3(VDD) U70.3(VDD) U71.3(VDD) U72.3(VDD) U73.3(VDD) U74.3(VDD) U75.3(VDD) U76.3(VDD) U77.3(VDD) U78.3(VDD) U79.3(VDD) U80.3(VDD) U81.3(VDD) U82.3(VDD) U85.3(VIN) U87.3(VIN) USB1.2(VBUS) USB1.11(VBUS)
GND: C1.1 C2.1 C3.1 C4.1 C5.1 C6.1 C7.1 C8.1 C9.1 C10.1 C11.1 C12.1 C13.1 C14.1 C15.1 C16.1 C17.1 C18.1 C19.1 C20.1 C21.1 C22.1 C23.1 C24.1 C25.1 C26.1 C27.1 C28.1 C29.1 C30.1 C31.1 C32.1 C33.1 C34.1 C35.1 C36.1 C37.1 C38.1 C39.1 C40.1 C41.1 C42.1 C43.1 C44.1 C45.1 C46.1 C47.1 C48.1 C49.1 C50.1 C51.1 C52.1 C53.1 C54.1 C55.1 C56.1 C57.1 C58.1 C59.1 C60.1 C61.1 C62.1 C63.1 C64.1 C65.1 C66.1 C67.1 C68.1 C69.1 C70.1 C71.1 C72.1 C73.1 C74.1 C75.1 C76.1 C77.1 C78.1 C79.1 C81.1 C82.1 C83.1 C84.1 C85.1 C86.1 C87.1 C88.1 C93.1 C94.1 C95.2 C96.2 C97.1 C98.1 C99.1 C100.2 C101.2 C102.2 C103.1 C104.1 C105.1 C106.1 C107.1 C108.1 C109.1 D86.2 FPC1.3 FPC2.3 R7.2 R8.2 R9.2 R10.2 R11.2 R12.2 SW1.1 SW2.1 U1.6(GND) U2.6(GND) U3.6(GND) U4.6(GND) U5.6(GND) U6.6(GND) U7.6(GND) U8.6(GND) U9.6(GND) U10.6(GND) U11.6(GND) U12.6(GND) U13.6(GND) U14.6(GND) U15.6(GND) U16.6(GND) U17.6(GND) U18.6(GND) U19.6(GND) U20.6(GND) U21.6(GND) U22.6(GND) U23.6(GND) U24.6(GND) U25.6(GND) U26.6(GND) U27.6(GND) U28.6(GND) U29.6(GND) U30.6(GND) U31.6(GND) U32.6(GND) U33.6(GND) U34.6(GND) U35.6(GND) U36.6(GND) U37.6(GND) U38.6(GND) U39.6(GND) U40.6(GND) U41.6(GND) U42.6(GND) U43.6(GND) U44.6(GND) U45.6(GND) U46.6(GND) U47.6(GND) U48.6(GND) U49.6(GND) U50.6(GND) U51.6(GND) U52.6(GND) U53.6(GND) U54.6(GND) U55.6(GND) U56.6(GND) U57.6(GND) U58.6(GND) U59.6(GND) U60.6(GND) U61.6(GND) U62.6(GND) U63.6(GND) U64.6(GND) U65.6(GND) U66.6(GND) U67.6(GND) U68.6(GND) U69.6(GND) U70.6(GND) U71.6(GND) U72.6(GND) U73.6(GND) U74.6(GND) U75.6(GND) U76.6(GND) U77.6(GND) U78.6(GND) U79.6(GND) U80.6(GND) U81.6(GND) U82.6(GND) U83.12(VSSA) U83.18(VSS_4) U83.28(PB2) U83.31(VSS_1) U83.47(VSS_2) U83.60(BOOT0) U83.63(VSS_3) U85.1(ADJ(GND)) U86.8(VSSA) U86.20(PB2) U86.23(VSS_1) U86.35(VSS_2) U86.44(BOOT0) U86.47(VSS_3) U87.1(ADJ(GND)) USB1.1(GND) USB1.12(GND) X1.2(GND) X1.4(GND) X2.2(GND) X2.4(GND)
COL1: D1.1(A) D15.1(A) D16.1(A) D17.1(A) D18.1(A) U83.14(PA0-WKUP)
COL2: D19.1(A) D20.1(A) D21.1(A) U83.15(PA1)
COL3: D2.1(A) D22.1(A) D23.1(A) D24.1(A) D25.1(A) U83.16(PA2)
COL4: D3.1(A) D26.1(A) D27.1(A) D28.1(A) D29.1(A) D30.1(A) U83.17(PA3)
COL5: D4.1(A) D31.1(A) D32.1(A) D33.1(A) D34.1(A) U83.20(PA4)
COL6: D5.1(A) D35.1(A) D36.1(A) D37.1(A) D38.1(A) U83.21(PA5)
COL7: D39.1(A) D40.1(A) D41.1(A) D42.1(A) D43.1(A) U83.22(PA6)
COL8: D6.1(A) D44.1(A) D45.1(A) D46.1(A) D47.1(A) U83.23(PA7)
COL9: D7.1(A) D48.1(A) D49.1(A) D50.1(A) D51.1(A) U83.39(PC8)
COL10: D8.1(A) D52.1(A) D53.1(A) D54.1(A) D55.1(A) U83.40(PC9)
COL11: D9.1(A) D56.1(A) D57.1(A) D58.1(A) D59.1(A) D60.1(A) U83.51(PC10)
COL12: D10.1(A) D61.1(A) D62.1(A) D63.1(A) D65.1(A) D66.1(A) U83.52(PC11)
COL13: D11.1(A) D67.1(A) D68.1(A) D69.1(A) D70.1(A) U83.53(PC12)
COL14: D12.1(A) D71.1(A) D72.1(A) D73.1(A) D74.1(A) U83.34(PB13)
COL15: D13.1(A) D75.1(A) D76.1(A) D77.1(A) D78.1(A) U83.35(PB14)
COL16: D14.1(A) D79.1(A) D80.1(A) D81.1(A) D82.1(A) D83.1(A) U83.36(PB15)
DN_IN: D86.1 USB1.5(DN2) USB1.7(DN1)
DN_OUT: D86.6 R15.1
DP_IN: D86.3 USB1.6(DP1) USB1.8(DP2)
DP_OUT: D86.4 R16.1
NRST_1: C84.2 R13.1 SW1.2 U83.7(NRST)
NRST_2: C99.2 R18.1 SW2.2 U86.7(NRST)
OSC_IN_1: C93.2 U83.5(PD0-OSC_IN) X1.3
OSC_IN_2: C97.2 U86.5(PD0-OSC_IN) X2.3
OSC_OUT_1: C94.2 U83.6(PD1-OSC_OUT) X1.1
OSC_OUT_2: C98.2 U86.6(PD1-OSC_OUT) X2.1
PA11: R15.2 U83.44(PA11)
PA12: R16.2 R17.1 U83.45(PA12)
RGB1: R1.1 U86.10(PA0-WKUP)
RGB2: R2.1 U86.11(PA1)
RGB3: R3.1 U86.16(PA6)
RGB4: R4.1 U86.18(PB0)
RGB5: R5.1 U86.19(PB1)
RGB6: R6.1 U86.21(PB10)
ROW1: U1.1(ROW) U2.1(ROW) U3.1(ROW) U4.1(ROW) U5.1(ROW) U6.1(ROW) U7.1(ROW) U8.1(ROW) U9.1(ROW) U10.1(ROW) U11.1(ROW) U12.1(ROW) U13.1(ROW) U14.1(ROW) U83.26(PB0)
ROW2: U15.1(ROW) U16.1(ROW) U17.1(ROW) U18.1(ROW) U19.1(ROW) U20.1(ROW) U21.1(ROW) U22.1(ROW) U23.1(ROW) U24.1(ROW) U25.1(ROW) U26.1(ROW) U27.1(ROW) U28.1(ROW) U29.1(ROW) U83.27(PB1)
ROW3: U30.1(ROW) U31.1(ROW) U32.1(ROW) U33.1(ROW) U34.1(ROW) U35.1(ROW) U36.1(ROW) U37.1(ROW) U38.1(ROW) U39.1(ROW) U40.1(ROW) U41.1(ROW) U42.1(ROW) U43.1(ROW) U44.1(ROW) U83.57(PB5)
ROW4: U45.1(ROW) U46.1(ROW) U47.1(ROW) U48.1(ROW) U49.1(ROW) U50.1(ROW) U51.1(ROW) U52.1(ROW) U53.1(ROW) U54.1(ROW) U55.1(ROW) U56.1(ROW) U57.1(ROW) U58.1(ROW) U83.58(PB6)
ROW5: U59.1(ROW) U60.1(ROW) U61.1(ROW) U62.1(ROW) U63.1(ROW) U64.1(ROW) U65.1(ROW) U66.1(ROW) U67.1(ROW) U68.1(ROW) U69.1(ROW) U70.1(ROW) U71.1(ROW) U81.1(ROW) U83.59(PB7)
ROW6: U72.1(ROW) U73.1(ROW) U74.1(ROW) U75.1(ROW) U76.1(ROW) U77.1(ROW) U78.1(ROW) U79.1(ROW) U80.1(ROW) U82.1(ROW) U83.61(PB8)
RX: U83.43(PA10) U86.12(PA2)
SWCLK_1: FPC1.4 U83.49(PA14)
SWCLK_2: FPC2.4 U86.37(PA14)
SWDIO_1: FPC1.2 U83.46(PA13)
SWDIO_2: FPC2.2 U86.34(PA13)
TX: U83.42(PA9) U86.13(PA3)
$1N78208: D39.2(K) U21.2(COL)
$1N78212: U20.5(DOUT) U21.4(DIN)
$1N78217: U5.5(DOUT) U6.4(DIN)
$1N78224: D40.2(K) U35.2(COL)
$1N78226: U34.5(DOUT) U35.4(DIN)
$1N78228: U35.5(DOUT) U36.4(DIN)
$1N78230: U21.5(DOUT) U22.4(DIN)
$1N78235: D36.2(K) U34.2(COL)
$1N78238: U33.5(DOUT) U34.4(DIN)
$1N78240: D5.2(K) U5.2(COL)
$1N78242: D35.2(K) U20.2(COL)
$1N78246: U19.5(DOUT) U20.4(DIN)
$1N78249: U64.5(DOUT) U65.4(DIN)
$1N78250: U50.5(DOUT) U51.4(DIN)
$1N78256: U63.5(DOUT) U64.4(DIN)
$1N78258: D42.2(K) U64.2(COL)
$1N78259: D41.2(K) U50.2(COL)
$1N78260: U49.5(DOUT) U50.4(DIN)
$1N78263: U62.5(DOUT) U63.4(DIN)
$1N78265: D38.2(K) U63.2(COL)
$1N78267: D43.2(K) U75.2(COL)
$1N78269: U74.5(DOUT) U75.4(DIN)
$1N78270: D37.2(K) U49.2(COL)
$1N78271: U48.5(DOUT) U49.4(DIN)
$1N78278: D34.2(K) U62.2(COL)
$1N78281: D33.2(K) U48.2(COL)
$1N78283: U4.5(DOUT) U5.4(DIN)
$1N78284: D32.2(K) U33.2(COL)
$1N78290: D31.2(K) U19.2(COL)
$1N78295: D4.2(K) U4.2(COL)
$1N78299: U26.5(DOUT) U27.4(DIN)
$1N78302: D62.2(K) U40.2(COL)
$1N78303: U10.5(DOUT) U11.4(DIN)
$1N78309: U25.5(DOUT) U26.4(DIN)
$1N78310: D61.2(K) U26.2(COL)
$1N78311: D10.2(K) U10.2(COL)
$1N78313: U9.5(DOUT) U10.4(DIN)
$1N78314: D56.2(K) U68.2(COL)
$1N78318: U53.5(DOUT) U54.4(DIN)
$1N78320: U38.5(DOUT) U39.4(DIN)
$1N78325: D58.2(K) U54.2(COL)
$1N78331: D66.2(K) U69.2(COL)
$1N78333: D70.2(K) U77.2(COL)
$1N78335: D69.2(K) U56.2(COL)
$1N78336: D63.2(K) U55.2(COL)
$1N78341: D68.2(K) U41.2(COL)
$1N78345: U40.5(DOUT) U41.4(DIN)
$1N78346: U55.5(DOUT) U56.4(DIN)
$1N78348: U76.5(DOUT) U82.4(DIN)
$1N78354: U77.4(DIN) U82.5(DOUT)
$1N78356: U77.5(DOUT) U78.4(DIN)
$1N78358: U69.5(DOUT) U70.4(DIN)
$1N78360: U68.5(DOUT) U69.4(DIN)
$1N78362: D65.2(K) U82.2(COL)
$1N78366: D59.2(K) U39.2(COL)
$1N78368: D9.2(K) U9.2(COL)
$1N78370: U24.5(DOUT) U25.4(DIN)
$1N78371: D60.2(K) U25.2(COL)
$1N78373: U8.5(DOUT) U9.4(DIN)
$1N78375: U67.5(DOUT) U68.4(DIN)
$1N78380: U75.5(DOUT) U76.4(DIN)
$1N78382: D57.2(K) U76.2(COL)
$1N78385: U57.5(DOUT) U58.4(DIN)
$1N78386: U54.5(DOUT) U55.4(DIN)
$1N78387: U39.5(DOUT) U40.4(DIN)
$1N78390: U78.5(DOUT) U79.4(DIN)
$1N78395: D74.2(K) U78.2(COL)
$1N78396: D73.2(K) U70.2(COL)
$1N78397: U56.5(DOUT) U57.4(DIN)
$1N78401: U13.5(DOUT) U14.4(DIN)
$1N78403: U12.5(DOUT) U13.4(DIN)
$1N78407: D13.2(K) U13.2(COL)
$1N78410: D12.2(K) U12.2(COL)
$1N78412: U11.5(DOUT) U12.4(DIN)
$1N78416: D76.2(K) U43.2(COL)
$1N78420: D78.2(K) U79.2(COL)
$1N78422: D77.2(K) U71.2(COL)
$1N78423: U70.5(DOUT) U71.4(DIN)
$1N78428: D75.2(K) U28.2(COL)
$1N78429: D83.2(K) U80.2(COL)
$1N78432: R11.1 U81.5(DOUT)
$1N78434: R10.1 U58.5(DOUT)
$1N78436: R9.1 U44.5(DOUT)
$1N78438: R12.1 U80.5(DOUT)
$1N78440: U79.5(DOUT) U80.4(DIN)
$1N78443: U71.5(DOUT) U81.4(DIN)
$1N78446: D81.2(K) U58.2(COL)
$1N78448: D82.2(K) U81.2(COL)
$1N78451: U43.5(DOUT) U44.4(DIN)
$1N78454: D80.2(K) U44.2(COL)
$1N78456: D79.2(K) U29.2(COL)
$1N78458: R8.1 U29.5(DOUT)
$1N78459: R7.1 U14.5(DOUT)
$1N78462: D14.2(K) U14.2(COL)
$1N78465: U28.5(DOUT) U29.4(DIN)
$1N78466: D72.2(K) U57.2(COL)
$1N78471: U42.5(DOUT) U43.4(DIN)
$1N78472: D71.2(K) U42.2(COL)
$1N78475: U41.5(DOUT) U42.4(DIN)
$1N78476: U27.5(DOUT) U28.4(DIN)
$1N78479: D11.2(K) U11.2(COL)
$1N78482: D67.2(K) U27.2(COL)
$1N78489: U23.5(DOUT) U24.4(DIN)
$1N78490: D52.2(K) U24.2(COL)
$1N78491: U7.5(DOUT) U8.4(DIN)
$1N78493: D8.2(K) U8.2(COL)
$1N78497: D53.2(K) U38.2(COL)
$1N78498: U37.5(DOUT) U38.4(DIN)
$1N78500: U52.5(DOUT) U53.4(DIN)
$1N78502: D54.2(K) U53.2(COL)
$1N78504: D7.2(K) U7.2(COL)
$1N78506: U22.5(DOUT) U23.4(DIN)
$1N78510: D48.2(K) U23.2(COL)
$1N78512: D49.2(K) U37.2(COL)
$1N78513: D50.2(K) U52.2(COL)
$1N78516: U51.5(DOUT) U52.4(DIN)
$1N78518: U36.5(DOUT) U37.4(DIN)
$1N78520: U6.5(DOUT) U7.4(DIN)
$1N78529: U65.5(DOUT) U66.4(DIN)
$1N78532: U66.5(DOUT) U67.4(DIN)
$1N78533: D55.2(K) U67.2(COL)
$1N78536: D47.2(K) U65.2(COL)
$1N78539: D51.2(K) U66.2(COL)
$1N78542: D46.2(K) U51.2(COL)
$1N78546: D45.2(K) U36.2(COL)
$1N78551: D44.2(K) U22.2(COL)
$1N78554: D6.2(K) U6.2(COL)
$1N78557: D15.2(K) U15.2(COL)
$1N78559: R3.2 U30.4(DIN)
$1N78560: R2.2 U15.4(DIN)
$1N78561: U15.5(DOUT) U16.4(DIN)
$1N78566: D1.2(K) U1.2(COL)
$1N78567: R1.2 U1.4(DIN)
$1N78571: D23.2(K) U31.2(COL)
$1N78575: U16.5(DOUT) U17.4(DIN)
$1N78582: D22.2(K) U17.2(COL)
$1N78583: D2.2(K) U2.2(COL)
$1N78585: U1.5(DOUT) U2.4(DIN)
$1N78589: D27.2(K) U32.2(COL)
$1N78592: D26.2(K) U18.2(COL)
$1N78596: D3.2(K) U3.2(COL)
$1N78600: U72.5(DOUT) U73.4(DIN)
$1N78601: D21.2(K) U73.2(COL)
$1N78605: D18.2(K) U72.2(COL)
$1N78607: R6.2 U72.4(DIN)
$1N78609: D30.2(K) U74.2(COL)
$1N78615: D29.2(K) U61.2(COL)
$1N78617: D28.2(K) U47.2(COL)
$1N78622: D20.2(K) U59.2(COL)
$1N78626: D17.2(K) U45.2(COL)
$1N78628: R4.2 U45.4(DIN)
$1N78629: U30.5(DOUT) U31.4(DIN)
$1N78631: U45.5(DOUT) U46.4(DIN)
$1N78633: D16.2(K) U30.2(COL)
$1N78637: D19.2(K) U16.2(COL)
$1N78639: U59.5(DOUT) U60.4(DIN)
$1N78647: D24.2(K) U46.2(COL)
$1N78648: D25.2(K) U60.2(COL)
$1N78649: U18.5(DOUT) U19.4(DIN)
$1N78650: U32.5(DOUT) U33.4(DIN)
$1N78651: U3.5(DOUT) U4.4(DIN)
$1N78654: U31.5(DOUT) U32.4(DIN)
$1N78657: U2.5(DOUT) U3.4(DIN)
$1N78658: U17.5(DOUT) U18.4(DIN)
$1N78659: U46.5(DOUT) U47.4(DIN)
$1N78660: U47.5(DOUT) U48.4(DIN)
$1N78669: U73.5(DOUT) U74.4(DIN)
$1N78670: U61.5(DOUT) U62.4(DIN)
$1N78671: U60.5(DOUT) U61.4(DIN)
$1N78676: R5.2 U59.4(DIN)

Not connected (* = marked no-connect by the designer): FPC1 5* 6*; FPC2 5* 6*; U83 1(VBAT)* 2(PC13-TAMPER-RTC)* 3(PC14-OSC32_IN)* 4(PC15-OSC32_OUT)* 8(PC0)* 9(PC1)* 10(PC2)* 11(PC3)* 24(PC4)* 25(PC5)* 29(PB10)* 30(PB11)* 33(PB12)* 37(PC6)* 38(PC7)* 41(PA8)* 50(PA15)* 54(PD2)* 55(PB3)* 56(PB4)* 62(PB9)*; U86 1(VBAT)* 2(PC13-TAMPER-RTC)* 3(PC14-OSC32_IN)* 4(PC15-OSC32_OUT)* 14(PA4)* 15(PA5)* 17(PA7)* 22(PB11)* 25(PB12)* 26(PB13)* 27(PB14)* 28(PB15)* 29(PA8)* 30(PA9)* 31(PA10)* 32(PA11)* 33(PA12)* 38(PA15)* 39(PB3)* 40(PB4)* 41(PB5)* 42(PB6)* 43(PB7)* 45(PB8)* 46(PB9)*; USB1 3(SBU2)* 4(CC1)* 9(SBU1)* 10(CC2)* 13(SHELL)* 14(SHELL)*

## Notes on the sheets
sheet 2
- 复位电路
- 5V转3.3V
- USB通信
- SWD下载调试
- 8M外部晶振
